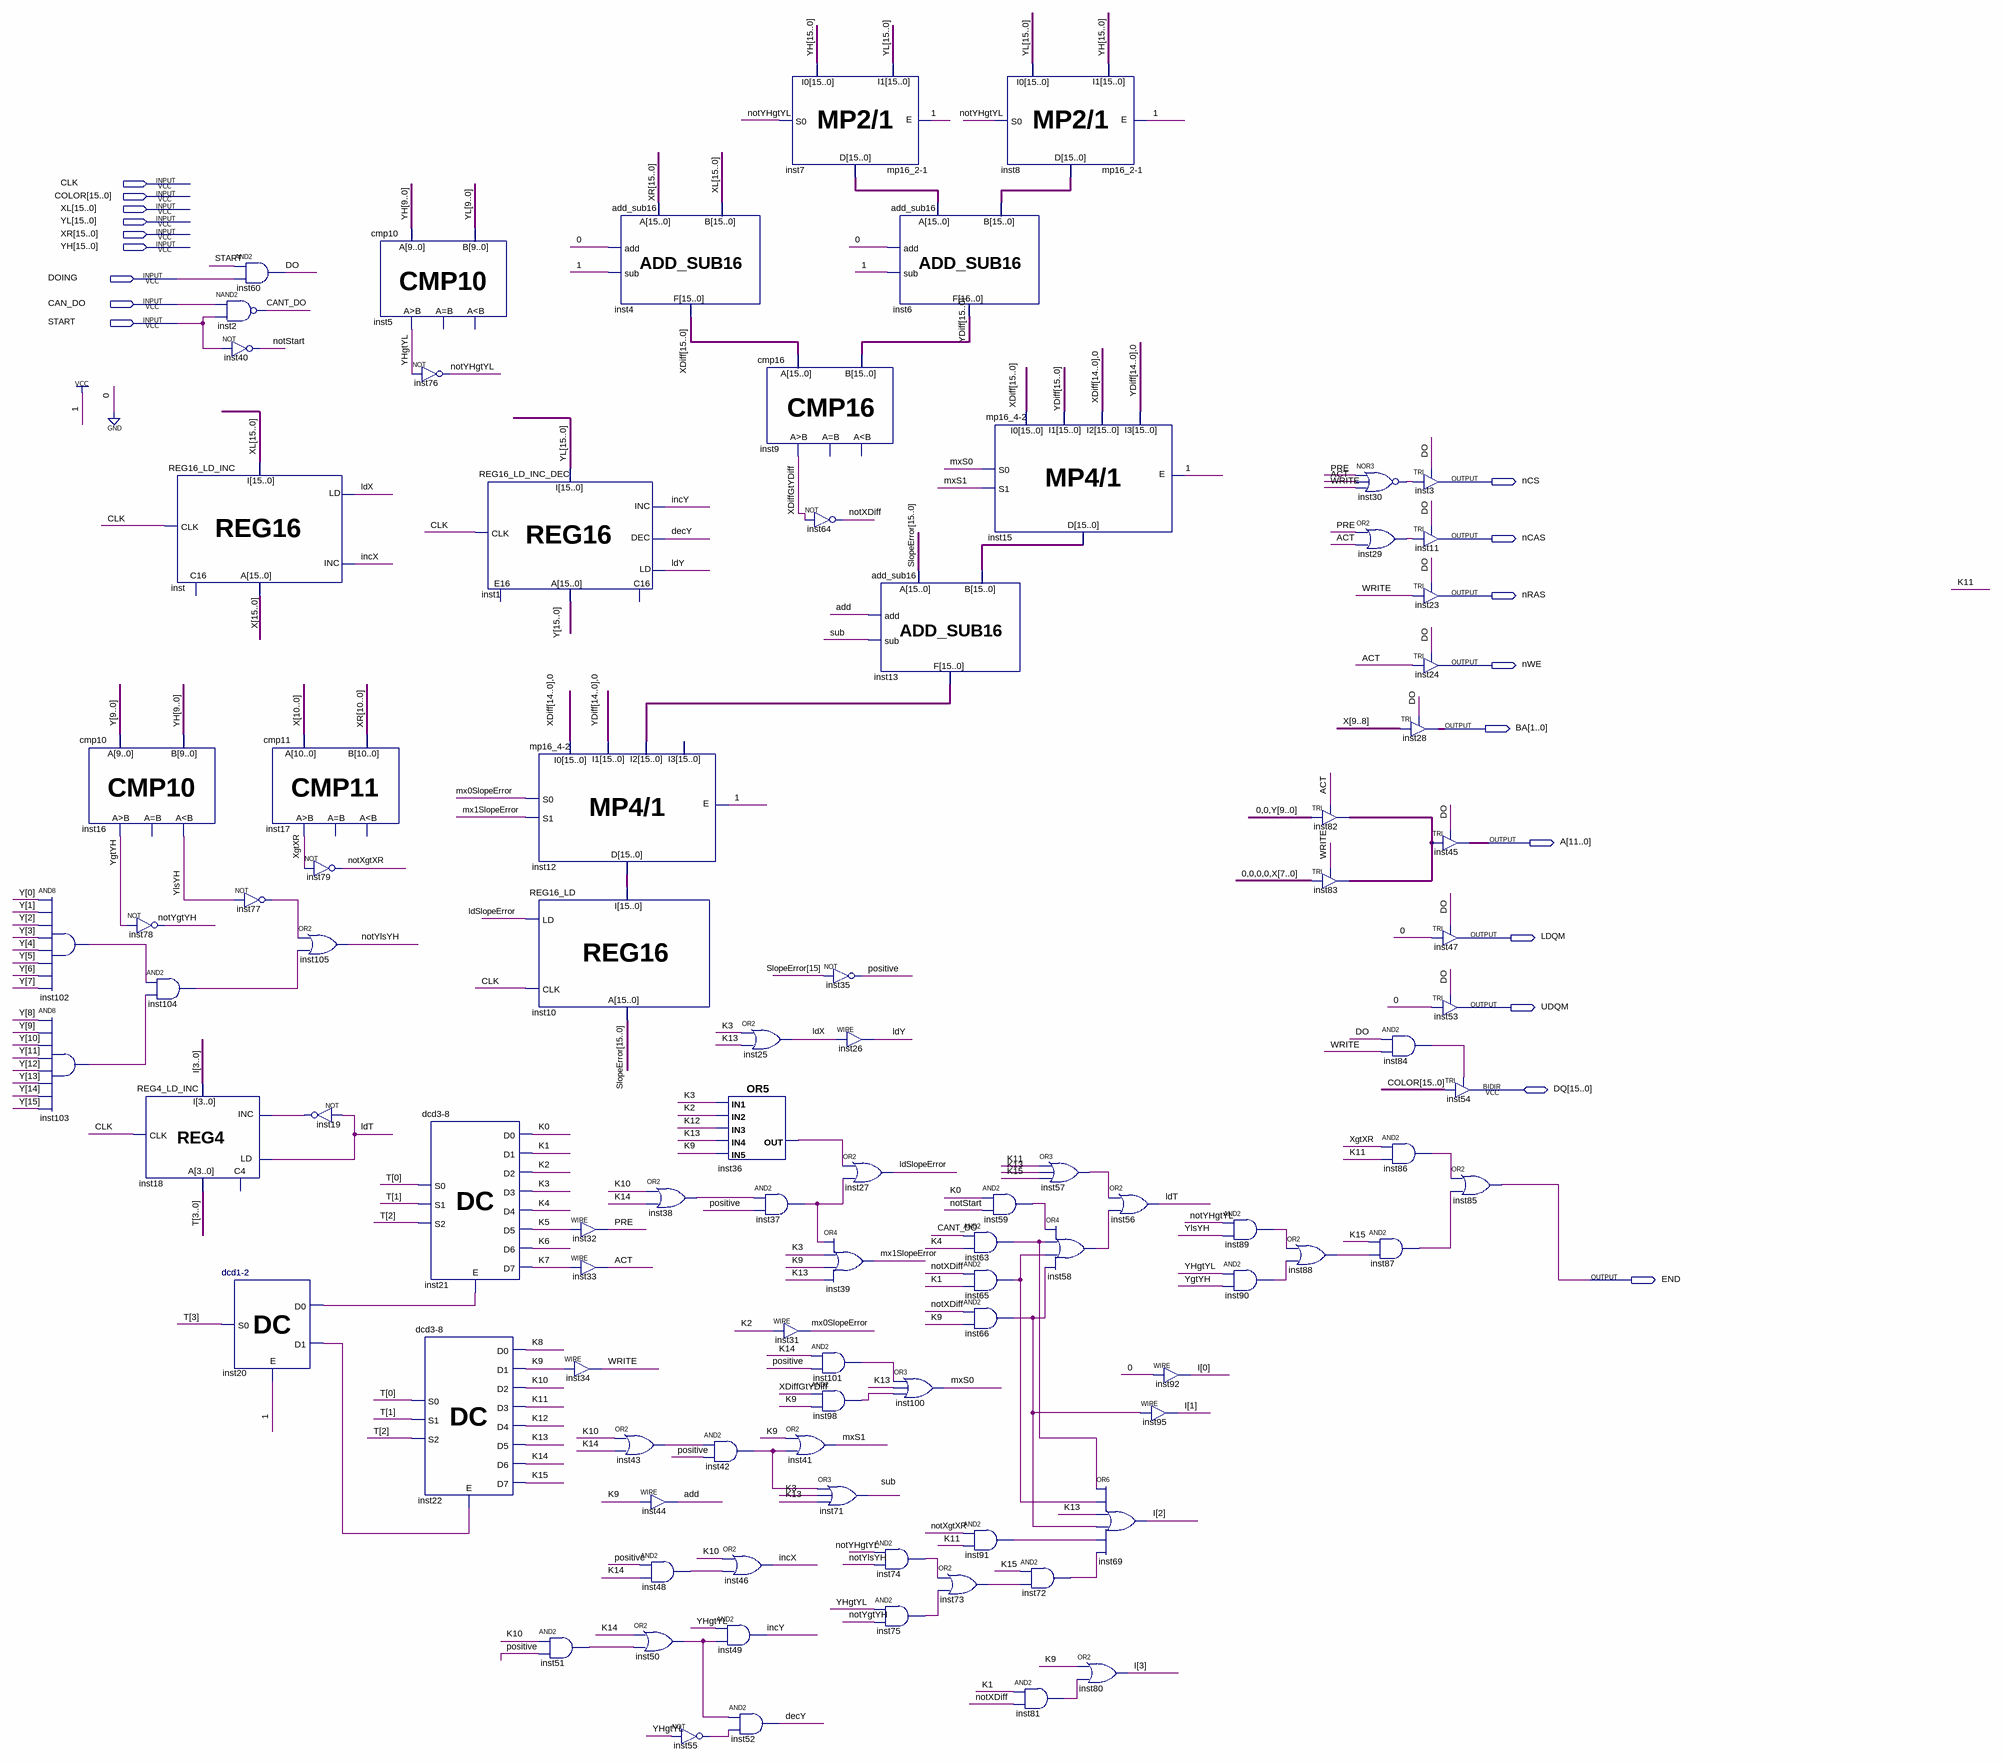
[diagram p0: schematic sheet]
// Quartus schematic GPU_write_line.bdf as structural Verilog: 95 symbols, 19 pins
module GPU_write_line (
  input  CLK,
  input  [15:0] COLOR,
  input  [15:0] XL,
  input  [15:0] YL,
  input  [15:0] XR,
  input  [15:0] YH,
  input  DOING,
  input  CAN_DO,
  input  START,
  inout  [15:0] DQ,
  output nCS,
  output nCAS,
  output nRAS,
  output nWE,
  output [1:0] BA,
  output [11:0] A,
  output LDQM,
  output UDQM,
  output END
);

  wire ACT, add, CANT_DO, decY, DO, incX, incY, inst19_out, inst20_d0, inst20_d1, inst29_out, inst30_out,
       inst36_out, inst37_out, inst38_out, inst42_out, inst43_out, inst48_out, inst50_out, inst51_out,
       inst55_out, inst57_out, inst58_out, inst59_out, inst63_out, inst65_out, inst66_out, inst72_out,
       inst73_out, inst74_out, inst75_out, inst77_out, inst81_out, inst84_out, inst86_out, inst87_out,
       inst88_out, inst89_out, inst90_out, inst91_out, inst98_out, inst101_out, inst102_out, inst103_out,
       inst104_out, K0, K1, K2, K3, K4, K5, K6, K7, K8, K9, K10, K11, K12, K13, K14, K15, ldSlopeError, ldT,
       ldX, ldY, mx0SlopeError, mx1SlopeError, mxS0, mxS1, notStart, notXDiff, notXgtXR, notYgtYH, notYHgtYL,
       notYlsYH, positive, PRE, sub, WRITE, XDiffGtYDiff, XgtXR, YgtYH, YHgtYL, YlsYH;
  wire [3:0] I, T;
  wire [11:0] inst82_out;
  wire [15:0] inst7_d, inst8_d, inst12_d, inst13_f, inst15_d, SlopeError, X, XDiff, Y, YDiff;

  and inst102 (inst102_out, Y[0], Y[1], Y[2], Y[3], Y[4], Y[5], Y[6], Y[7]);
  and inst103 (inst103_out, Y[8], Y[9], Y[10], Y[11], Y[12], Y[13], Y[14], Y[15]);
  cmp10 inst16 (.A(Y[9:0]), .B(YH[9:0]), .Ls(YlsYH), .Gt(YgtYH));  // open: Eq
  not inst78 (notYgtYH, YgtYH);
  and inst104 (inst104_out, inst102_out, inst103_out);
  REG4_LD_INC inst18 (.LD(ldT), .INC(inst19_out), .CLK(CLK), .I(I), .A(T));  // open: C4
  REG16_LD_INC inst (.I(XL), .CLK(CLK), .LD(ldX), .INC(incX), .A(X));  // open: C16
  and inst60 (DO, START, DOING);
  nand inst2 (CANT_DO, CAN_DO, START);
  not inst40 (notStart, START);
  not inst77 (inst77_out, YlsYH);
  \dcd1-2  inst20 (.E(1'b1), .S0(T[3]), .D0(inst20_d0), .D1(inst20_d1));
  cmp11 inst17 (.A(X[10:0]), .B(XR[10:0]), .Gt(XgtXR));  // open: Ls, Eq
  not inst79 (notXgtXR, XgtXR);
  or inst105 (notYlsYH, inst77_out, inst104_out);
  not inst19 (inst19_out, ldT);
  cmp10 inst5 (.A(YH[9:0]), .B(YL[9:0]), .Gt(YHgtYL));  // open: Ls, Eq
  not inst76 (notYHgtYL, YHgtYL);
  \dcd3-8  inst21 (
    .E(inst20_d0), .S0(T[0]), .S1(T[1]), .S2(T[2]), .D0(K0), .D1(K1), .D2(K2), .D3(K3), .D4(K4), .D5(K5),
    .D6(K6), .D7(K7));
  \dcd3-8  inst22 (
    .E(inst20_d1), .S0(T[0]), .S1(T[1]), .S2(T[2]), .D0(K8), .D1(K9), .D2(K10), .D3(K11), .D4(K12), .D5(K13),
    .D6(K14), .D7(K15));
  REG16_LD_INC_DEC inst1 (.LD(ldY), .DEC(decY), .INC(incY), .CLK(CLK), .I(YL), .A(Y));  // open: C16, E16
  \mp16_4-2  inst12 (
    .E(1'b1), .I0({XDiff[14:0], 1'b0}), .I1({YDiff[14:0], 1'b0}), .I2(inst13_f), .S0(mx0SlopeError),
    .S1(mx1SlopeError), .D(inst12_d));  // open: I3
  REG16_LD inst10 (.I(inst12_d), .CLK(CLK), .LD(ldSlopeError), .A(SlopeError));
  and inst51 (inst51_out, K10, positive);
  add_sub16 inst4 (.A(XR), .B(XL), .add(1'b0), .sub(1'b1), .F(XDiff));
  assign PRE = K5;  // WIRE inst32
  assign ACT = K7;  // WIRE inst33
  assign WRITE = K9;  // WIRE inst34
  or inst38 (inst38_out, K10, K14);
  or inst43 (inst43_out, K10, K14);
  assign add = K9;  // WIRE inst44
  and inst48 (inst48_out, positive, K14);
  or inst50 (inst50_out, K14, inst51_out);
  and inst42 (inst42_out, inst43_out, positive);
  not inst55 (inst55_out, YHgtYL);
  cmp16 inst9 (.A(XDiff), .B(YDiff), .Gt(XDiffGtYDiff));  // open: Eq, Ls
  or inst25 (ldX, K3, K13);
  or inst36 (inst36_out, K3, K2, K12, K13, K9);
  and inst37 (inst37_out, inst38_out, positive);
  or inst46 (incX, K10, inst48_out);
  and inst49 (incY, YHgtYL, inst50_out);
  and inst52 (decY, inst50_out, inst55_out);
  \mp16_2-1  inst7 (.E(1'b1), .I0(YH), .I1(YL), .S0(notYHgtYL), .D(inst7_d));
  not inst64 (notXDiff, XDiffGtYDiff);
  assign mx0SlopeError = K2;  // WIRE inst31
  and inst101 (inst101_out, K14, positive);
  and inst98 (inst98_out, XDiffGtYDiff, K9);
  or inst41 (mxS1, K9, inst42_out);
  not inst35 (positive, SlopeError[15]);
  assign ldY = ldX;  // WIRE inst26
  or inst27 (ldSlopeError, inst36_out, inst37_out);
  or inst39 (mx1SlopeError, inst37_out, K3, K9, K13);
  or inst71 (sub, inst42_out, K3, K13);
  add_sub16 inst6 (.A(inst7_d), .B(inst8_d), .add(1'b0), .sub(1'b1), .F(YDiff));
  add_sub16 inst13 (.A(SlopeError), .B(inst15_d), .add(add), .sub(sub), .F(inst13_f));
  or inst100 (mxS0, inst101_out, K13, inst98_out);
  and inst74 (inst74_out, notYHgtYL, notYlsYH);
  and inst75 (inst75_out, YHgtYL, notYgtYH);
  and inst63 (inst63_out, CANT_DO, K4);
  and inst65 (inst65_out, notXDiff, K1);
  and inst66 (inst66_out, notXDiff, K9);
  and inst91 (inst91_out, notXgtXR, K11);
  or inst73 (inst73_out, inst74_out, inst75_out);
  \mp16_2-1  inst8 (.E(1'b1), .I0(YL), .I1(YH), .S0(notYHgtYL), .D(inst8_d));
  \mp16_4-2  inst15 (
    .E(1'b1), .I0(XDiff), .I1(YDiff), .I2({XDiff[14:0], 1'b0}), .I3({YDiff[14:0], 1'b0}), .S0(mxS0),
    .S1(mxS1), .D(inst15_d));
  and inst59 (inst59_out, K0, notStart);
  and inst81 (inst81_out, K1, notXDiff);
  or inst57 (inst57_out, K11, K13, K15);
  or inst58 (inst58_out, inst59_out, inst63_out, inst65_out, inst66_out);
  and inst72 (inst72_out, K15, inst73_out);
  or inst56 (ldT, inst57_out, inst58_out);
  or inst69 (I[2], inst63_out, inst65_out, K13, inst66_out, inst91_out, inst72_out);
  or inst80 (I[3], K9, inst81_out);
  assign I[0] = 1'b0;  // WIRE inst92
  assign I[1] = inst66_out;  // WIRE inst95
  and inst89 (inst89_out, notYHgtYL, YlsYH);
  and inst90 (inst90_out, YHgtYL, YgtYH);
  TRI inst82[11:0] (.IN({2'b00, Y[9:0]}), .OE(ACT), .OUT(inst82_out));
  TRI inst83[11:0] (.IN({4'b0000, X[7:0]}), .OE(WRITE), .OUT(inst82_out));
  or inst88 (inst88_out, inst89_out, inst90_out);
  nor inst30 (inst30_out, PRE, ACT, WRITE);
  or inst29 (inst29_out, PRE, ACT);
  and inst87 (inst87_out, K15, inst88_out);
  TRI inst3 (.IN(inst30_out), .OE(DO), .OUT(nCS));
  TRI inst11 (.IN(inst29_out), .OE(DO), .OUT(nCAS));
  TRI inst23 (.IN(WRITE), .OE(DO), .OUT(nRAS));
  TRI inst24 (.IN(ACT), .OE(DO), .OUT(nWE));
  TRI inst28[1:0] (.IN(X[9:8]), .OE(DO), .OUT(BA));
  and inst84 (inst84_out, DO, WRITE);
  and inst86 (inst86_out, XgtXR, K11);
  TRI inst45[11:0] (.IN(inst82_out), .OE(DO), .OUT(A));
  TRI inst47 (.IN(1'b0), .OE(DO), .OUT(LDQM));
  TRI inst53 (.IN(1'b0), .OE(DO), .OUT(UDQM));
  TRI inst54[15:0] (.IN(COLOR), .OE(inst84_out), .OUT(DQ));
  or inst85 (END, inst86_out, inst87_out);
endmodule
